# EAGLE design display300 (EAGLE 4.15)
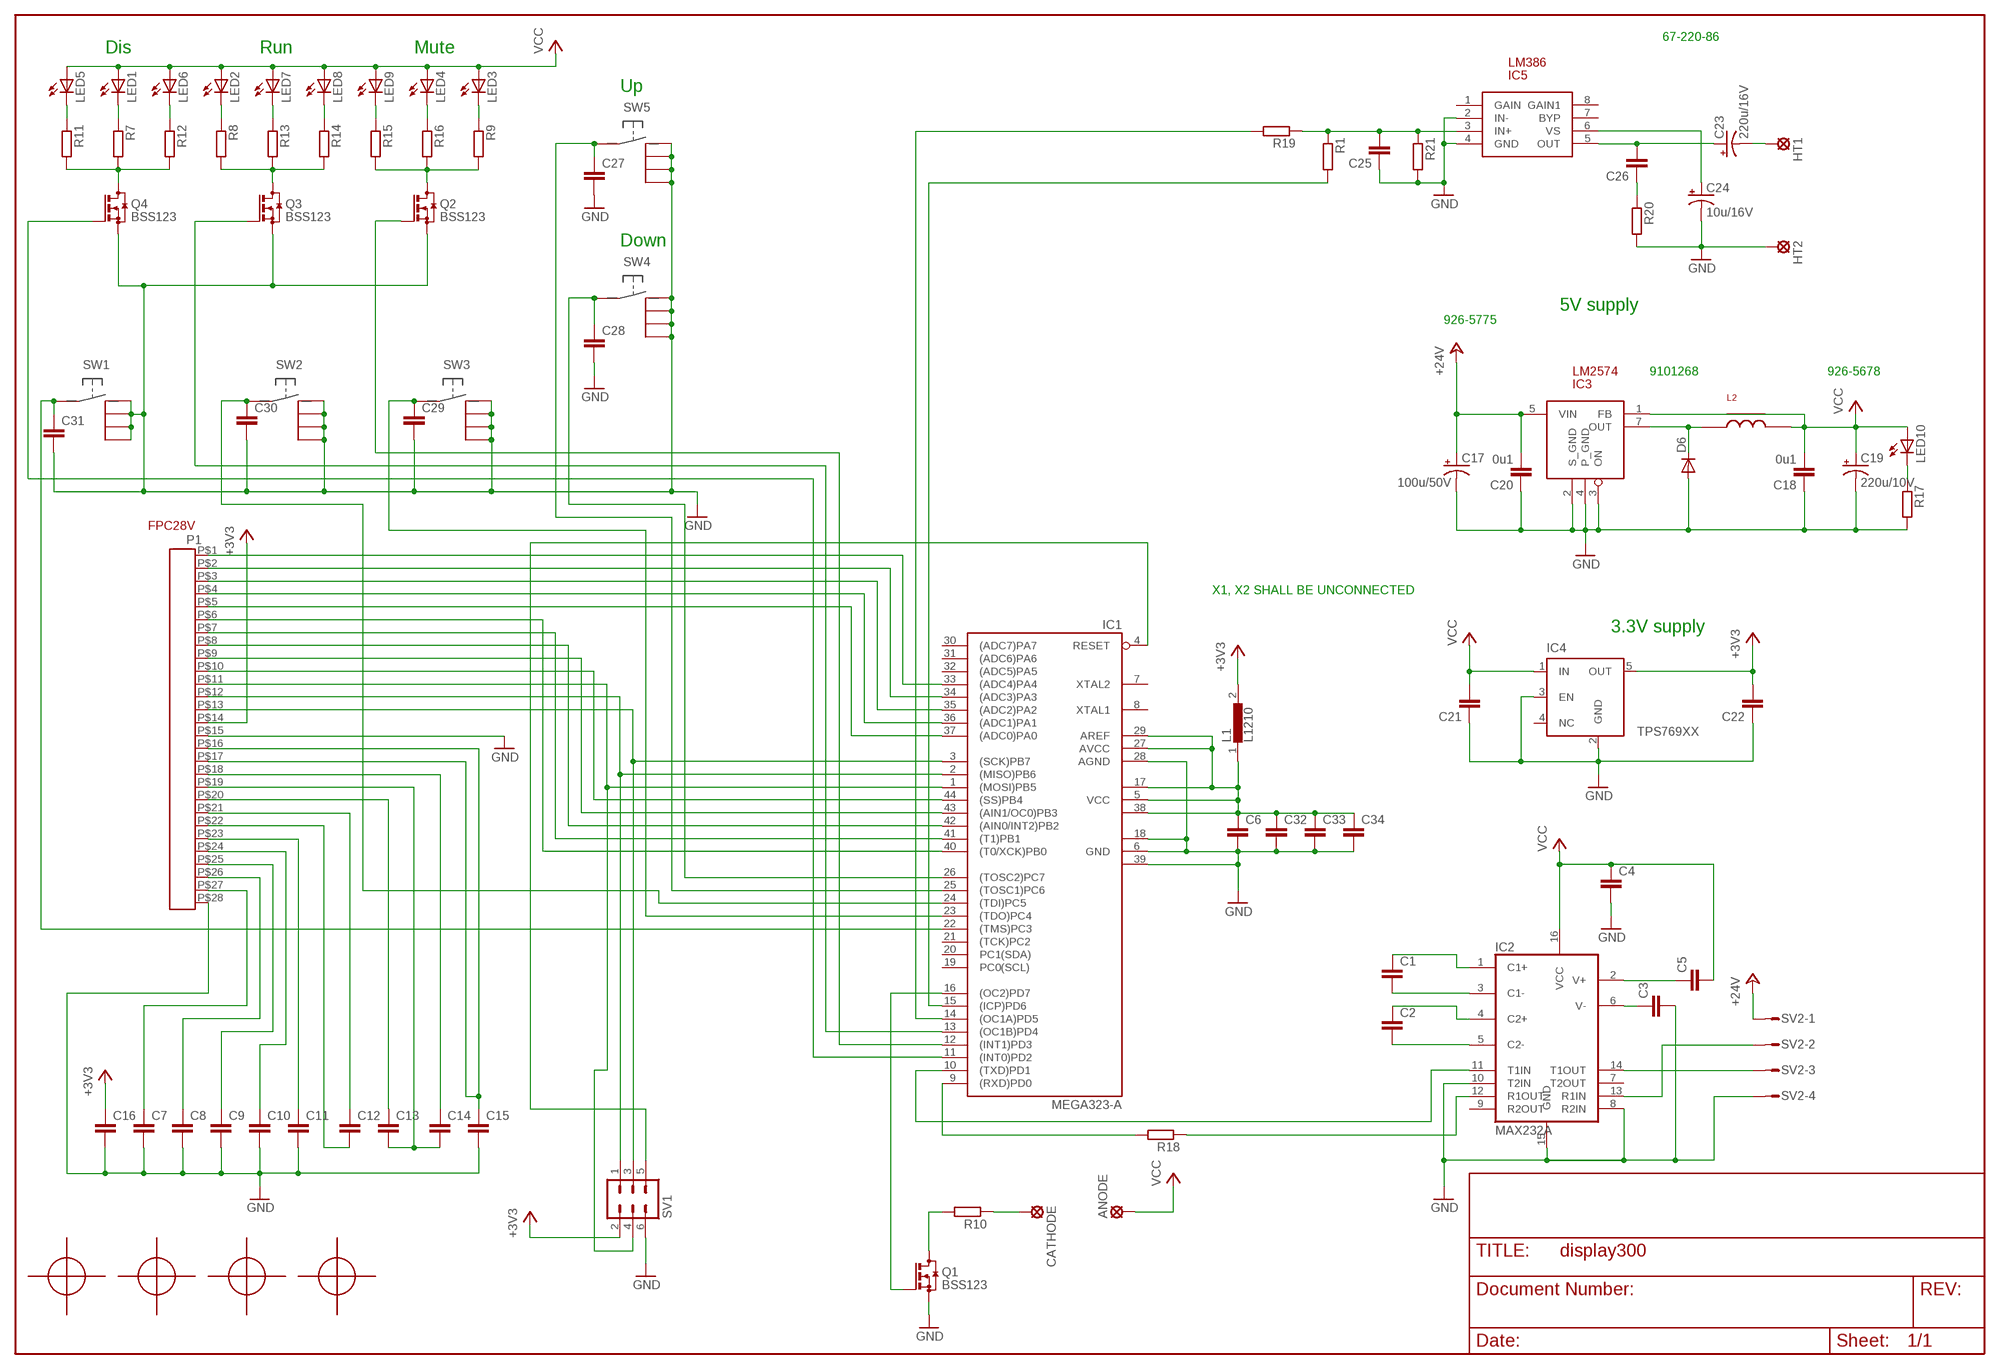
[diagram p0: schematic, sheet 1]

## Parts
ANODE  LSP13  [LSP13]
C1  C-EUC0805K  [C0805K]
C2  C-EUC0805K  [C0805K]
C3  C-EUC0805K  [C0805K]
C4  C-EUC0805K  [C0805K]
C5  C-EUC0805K  [C0805K]
C6  C-EUC0805K  [C0805K]
C7  C-EUC0805K  [C0805K]
C8  C-EUC0805K  [C0805K]
C9  C-EUC0805K  [C0805K]
C10  C-EUC0805K  [C0805K]
C11  C-EUC0805K  [C0805K]
C12  C-EUC0805K  [C0805K]
C13  C-EUC0805K  [C0805K]
C14  C-EUC0805K  [C0805K]
C15  C-EUC0805K  [C0805K]
C16  C-EUC0805K  [C0805K]
C17  100u/50V  CPOL-USE  [PANASONIC_E]
C18  0u1  C-EUC0805K  [C0805K]
C19  220u/10V  CPOL-USD  [PANASONIC_D]
C20  0u1  C-EUC0805K  [C0805K]
C21  C-EUC0805K  [C0805K]
C22  C-EUC0805K  [C0805K]
C23  220u/16V  CPOL-USD  [PANASONIC_D]
C24  10u/16V  CPOL-USB  [PANASONIC_B]
C25  C-EUC0805K  [C0805K]
C26  C-EUC0805K  [C0805K]
C27  C-EUC0805K  [C0805K]
C28  C-EUC0805K  [C0805K]
C29  C-EUC0805K  [C0805K]
C30  C-EUC0805K  [C0805K]
C31  C-EUC0805K  [C0805K]
C32  C-EUC0805K  [C0805K]
C33  C-EUC0805K  [C0805K]
C34  C-EUC0805K  [C0805K]
CATHODE  LSP13  [LSP13]
D6  DIODE-SMB  [SMB]
HT1  LSP13  [LSP13]
HT2  LSP13  [LSP13]
IC1  MEGA323-A  [TQFP44]
IC2  MAX232A  [SO16]
IC3  LM2574  [SO8]
IC4  TPS769XX  [SOT23-5]
IC5  LM386  [SO8]
L1  L1210  [C1210]
L2  IND_KOA_330U  [IND_KOA_330U]
LED1  LEDSMT1206  [1206]
LED2  LEDSMT1206  [1206]
LED3  LEDSMT1206  [1206]
LED4  LEDSMT1206  [1206]
LED5  LEDSMT1206  [1206]
LED6  LEDSMT1206  [1206]
LED7  LEDSMT1206  [1206]
LED8  LEDSMT1206  [1206]
LED9  LEDSMT1206  [1206]
LED10  LEDSMT1206  [1206]
P1  FPC28V  [FPC28V]
Q1  BSS123  [SOT23]
Q2  BSS123  [SOT23]
Q3  BSS123  [SOT23]
Q4  BSS123  [SOT23]
R1  R-EU_R0805W  [R0805W]
R7  R-EU_R0805W  [R0805W]
R8  R-EU_R0805W  [R0805W]
R9  R-EU_R0805W  [R0805W]
R10  R-EU_R0805W  [R0805W]
R11  R-EU_R0805W  [R0805W]
R12  R-EU_R0805W  [R0805W]
R13  R-EU_R0805W  [R0805W]
R14  R-EU_R0805W  [R0805W]
R15  R-EU_R0805W  [R0805W]
R16  R-EU_R0805W  [R0805W]
R17  R-EU_R0805W  [R0805W]
R18  R-EU_R0805W  [R0805W]
R19  R-EU_R0805W  [R0805W]
R20  R-EU_R0805W  [R0805W]
R21  R-EU_R0805W  [R0805W]
SV1  MA03-2  [MA03-2]
SV2  S04P  [S04P]
SW1  GPV_PUSH  [GPV_PUSH]
SW2  GPV_PUSH  [GPV_PUSH]
SW3  GPV_PUSH  [GPV_PUSH]
SW4  GPV_PUSH  [GPV_PUSH]
SW5  GPV_PUSH  [GPV_PUSH]
U$1  FEDUSIAL_1MM  [FEDUSIAL_1MM]
U$2  FEDUSIAL_1MM  [FEDUSIAL_1MM]
U$3  FEDUSIAL_1MM  [FEDUSIAL_1MM]
U$4  FEDUSIAL_1MM  [FEDUSIAL_1MM]

## Nets
+3V3: C16.1 C22.2 IC4.5(OUT) L1.2 P1.P$14 SV1.2
+24V: C17.+ C20.2 IC3.5(VIN) SV2.1
GND: C3.2 C4.2 C6.2 C7.2 C8.2 C9.2 C10.2 C11.2 C15.2 C16.2 C17.- C18.1 C19.- C20.1 C21.1 C22.1 C24.- C25.1 C27.2 C28.2 C29.2 C30.2 C31.2 C32.2 C33.2 C34.2 D6.A HT2.MP IC1.6(GND) IC1.18(GND1) IC1.28(AGND) IC1.39(GND2) IC2.8(R2IN) IC2.10(T2IN) IC2.15(GND) IC3.2(S_GND) IC3.3(ON) IC3.4(P_GND) IC4.2(GND) IC4.3(EN) IC5.2(IN-) IC5.4(GND) P1.P$15 P1.P$28 Q1.2(S) Q2.2(S) Q3.2(S) Q4.2(S) R17.2 R20.2 R21.2 SV1.6 SV2.4 SW1.P$2 SW1.P$3 SW1.P$4 SW1.P$5 SW2.P$2 SW2.P$3 SW2.P$4 SW2.P$5 SW3.P$2 SW3.P$3 SW3.P$4 SW3.P$5 SW4.P$2 SW4.P$3 SW4.P$4 SW4.P$5 SW5.P$2 SW5.P$3 SW5.P$4 SW5.P$5
N$1: IC1.40((T0/XCK)PB0) P1.P$6
N$2: IC1.41((T1)PB1) P1.P$7
N$3: IC1.42((AIN0/INT2)PB2) P1.P$8
N$4: IC1.43((AIN1/OC0)PB3) P1.P$9
N$5: IC1.44((SS)PB4) P1.P$10
N$6: IC1.1((MOSI)PB5) P1.P$11 SV1.4
N$7: IC1.2((MISO)PB6) P1.P$12 SV1.1
N$8: IC1.3((SCK)PB7) P1.P$13 SV1.3
N$9: IC1.37((ADC0)PA0) P1.P$5
N$10: IC1.36((ADC1)PA1) P1.P$4
N$11: IC1.35((ADC2)PA2) P1.P$3
N$12: IC1.34((ADC3)PA3) P1.P$2
N$13: IC1.33((ADC4)PA4) P1.P$1
N$14: C15.1 P1.P$16 P1.P$17
N$15: C27.1 IC1.25((TOSC1)PC6) SW5.P$1
N$16: C14.1 P1.P$18
N$17: C13.2 C14.2 P1.P$19
N$18: C13.1 P1.P$20
N$19: C12.1 P1.P$21
N$20: C12.2 P1.P$22
N$21: C11.1 P1.P$23
N$22: C10.1 P1.P$24
N$23: C9.1 P1.P$25
N$24: C8.1 P1.P$26
N$25: C7.1 P1.P$27
N$27: LED3.C R9.1
N$28: C6.1 C32.1 C33.1 C34.1 IC1.5(VCC) IC1.17(VCC1) IC1.27(AVCC) IC1.29(AREF) IC1.38(VCC2) L1.1
N$29: LED2.C R8.1
N$30: LED1.C R7.1
N$31: IC2.14(T1OUT) SV2.3
N$32: IC1.11((INT0)PD2) Q4.1(G)
N$33: IC2.13(R1IN) SV2.2
N$34: IC1.10((TXD)PD1) IC2.11(T1IN)
N$35: IC1.9((RXD)PD0) R18.2
N$36: C2.2 IC2.5(C2-)
N$37: C2.1 IC2.4(C2+)
N$38: C1.2 IC2.3(C1-)
N$39: C1.1 IC2.1(C1+)
N$40: C5.1 IC2.2(V+)
N$41: C3.1 IC2.6(V-)
N$42: IC1.13((OC1B)PD4) Q3.1(G)
N$43: IC1.4(RESET) SV1.5
N$44: IC1.12((INT1)PD3) Q2.1(G)
N$45: LED5.C R11.1
N$46: Q1.3(D) R10.2
N$47: LED6.C R12.1
N$48: LED7.C R13.1
N$49: Q4.3(D) R7.2 R11.2 R12.2
N$50: Q3.3(D) R8.2 R13.2 R14.2
N$51: CATHODE.MP R10.1
N$52: D6.C IC3.7(OUT) L2.P$1
N$53: Q2.3(D) R9.2 R15.2 R16.2
N$54: IC1.16((OC2)PD7) Q1.1(G)
N$55: LED10.C R17.1
N$56: LED8.C R14.1
N$57: LED9.C R15.1
N$58: LED4.C R16.1
N$59: IC2.12(R1OUT) R18.1
N$60: C23.+ C26.2 IC5.5(OUT)
N$61: C26.1 R20.1
N$62: C24.+ IC5.6(VS)
N$63: C23.- HT1.MP
N$64: C25.2 IC5.3(IN+) R1.1 R19.1 R21.1
N$65: IC1.14((OC1A)PD5) R19.2
N$66: IC1.15((ICP)PD6) R1.2
N$68: C28.1 IC1.26((TOSC2)PC7) SW4.P$1
N$71: C31.1 IC1.22((TMS)PC3) SW1.P$1
N$72: C30.1 IC1.24((TDI)PC5) SW2.P$1
N$73: C29.1 IC1.23((TDO)PC4) SW3.P$1
VCC: ANODE.MP C4.1 C5.2 C18.2 C19.+ C21.2 IC2.16(VCC) IC3.1(FB) IC4.1(IN) L2.P$4 LED1.A LED2.A LED3.A LED4.A LED5.A LED6.A LED7.A LED8.A LED9.A LED10.A
Unconnected: IC1.7(XTAL2) IC1.8(XTAL1) IC1.19(PC0(SCL)) IC1.20(PC1(SDA)) IC1.21((TCK)PC2) IC1.30((ADC7)PA7) IC1.31((ADC6)PA6) IC1.32((ADC5)PA5) IC2.7(T2OUT) IC2.9(R2OUT) IC4.4(NC) IC5.1(GAIN) IC5.7(BYP) IC5.8(GAIN1)

## Notes on the sheet
- 67-220-86
- Dis | Run | Mute
- Up
- Down
- 5V supply
- 926-5775
- 9101268 | 926-5678
- X1, X2 SHALL BE UNCONNECTED
- 3.3V supply

## Library data of the parts
ANODE CATHODE HT1 HT2 = solpad:LSP13: SOLDER PAD drill 1.3 mm, distributor Buerklin, 12H562
C1-C16 C18 C20-C22 C25-C34 = rcl:C-EU: CAPACITOR, European symbol
C17 C19 C23 C24 = rcl:CPOL-US: POLARIZED CAPACITOR, American symbol
D6 = diode:DIODE-: DIODE
IC1 = avr:MEGA323: MICROCONTROLLER 32 Kbytes FLASH 2 Kbytes SRAM 1 Kbytes EEPROM USART 8-channel 10 bit ADC
IC2 = lbm:MAX232A
IC3 = lbm:LM2574
IC4 = lbm:TPS769XX
IC5 = lbm:LM386
L1 = lbm:L1210
L2 = lbm:IND_KOA_330U
LED1-LED10 = led:LED: LED OSRAM: - CHIPLED LG R971, LG N971, LY N971, LG Q971, LY Q971, LO R971, LY R971 LH N974, LH R974 LS Q976, LO Q976, LY Q976 LO Q996 - Hyper CHIPLED LW Q18S LB Q993, LB Q99A, LB R99A - SideLED LS A670, LO A670, LY A670, LG A670, LP A670 LB A673, LV A673, LT A673, LW A673 LH A674 LY A675 LS A676, LA A676, LO A676, LY A676, LW A676 LS A679, LY A679, LG A679 - Hyper Micro SIDELED® LS Y876, LA Y876, LO Y876, LY Y876 LT Y87S - SmartLED LW L88C, LW L88S LB L89C, LB L89S, LG L890 LS L89K, LO L89K, LY L89K LS L896, LA L896, LO L896, LY L896 - TOPLED LS T670, LO T670, LY T670, LG T670, LP T670 LSG T670, LSP T670, LSY T670, LOP T670, LYG T670 LG T671, LOG T671, LSG T671 LB T673, LV T673, LT T673, LW T673 LH T674 LS T676, LA T676, LO T676, LY T676, LB T676, LH T676, LSB T676, LW T676 LB T67C, LV T67C, LT T67C, LS T67K, LO T67K, LY T67K, LW E67C LS E67B, LA E67B, LO E67B, LY E67B, LB E67C, LV E67C, LT E67C LW T67C LS T679, LY T679, LG T679 LS T770, LO T770, LY T770, LG T770, LP T770 LB T773, LV T773, LT T773, LW T773 LH T774 LS E675, LA E675, LY E675, LS T675 LS T776, LA T776, LO T776, LY T776, LB T776 LHGB T686 LT T68C, LB T68C - Hyper Mini TOPLED® LB M676 - Mini TOPLED Santana® LG M470 LS M47K, LO M47K, LY M47K Source: http://www.osram.convergy.de/
P1 = lbm:FPC28V
Q1-Q4 = transistor-small-signal:BSS123: N-CHANNEL MOS FET
R1 R7-R21 = rcl:R-EU_: RESISTOR, European symbol
SV1 = con-lstb:MA03-2: PIN HEADER
SV2 = con-amp-mt:S04P: AMP MT CONNECTOR
SW1-SW5 = lbm:GPV_PUSH
U$1-U$4 = lbm:FEDUSIAL_1MM

## Board
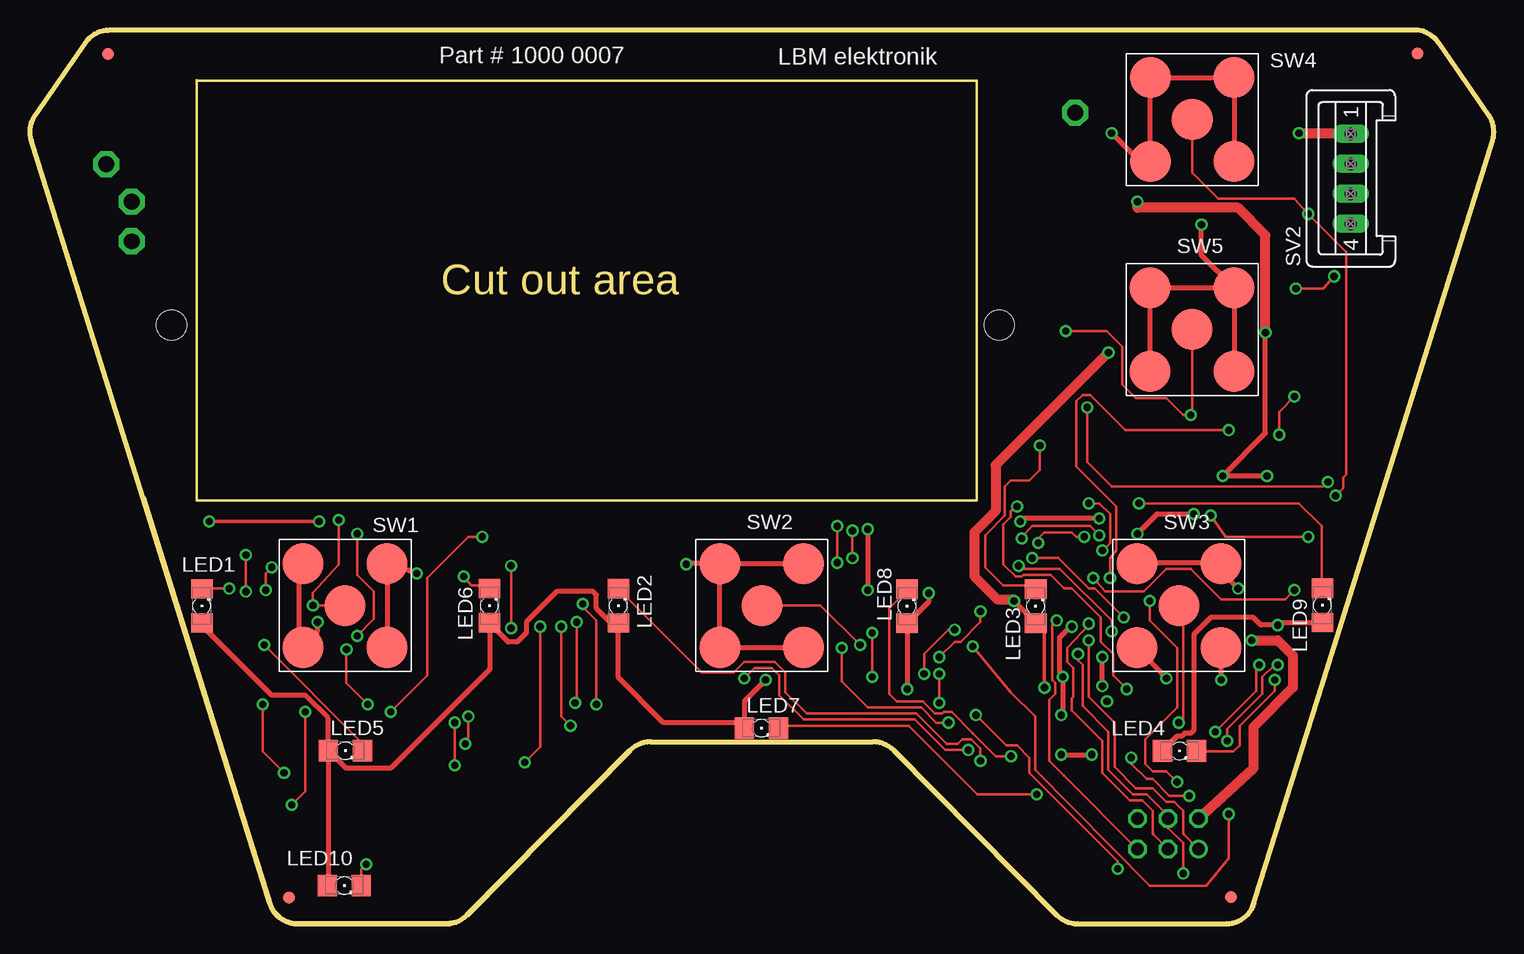
[diagram p1: board, top side]
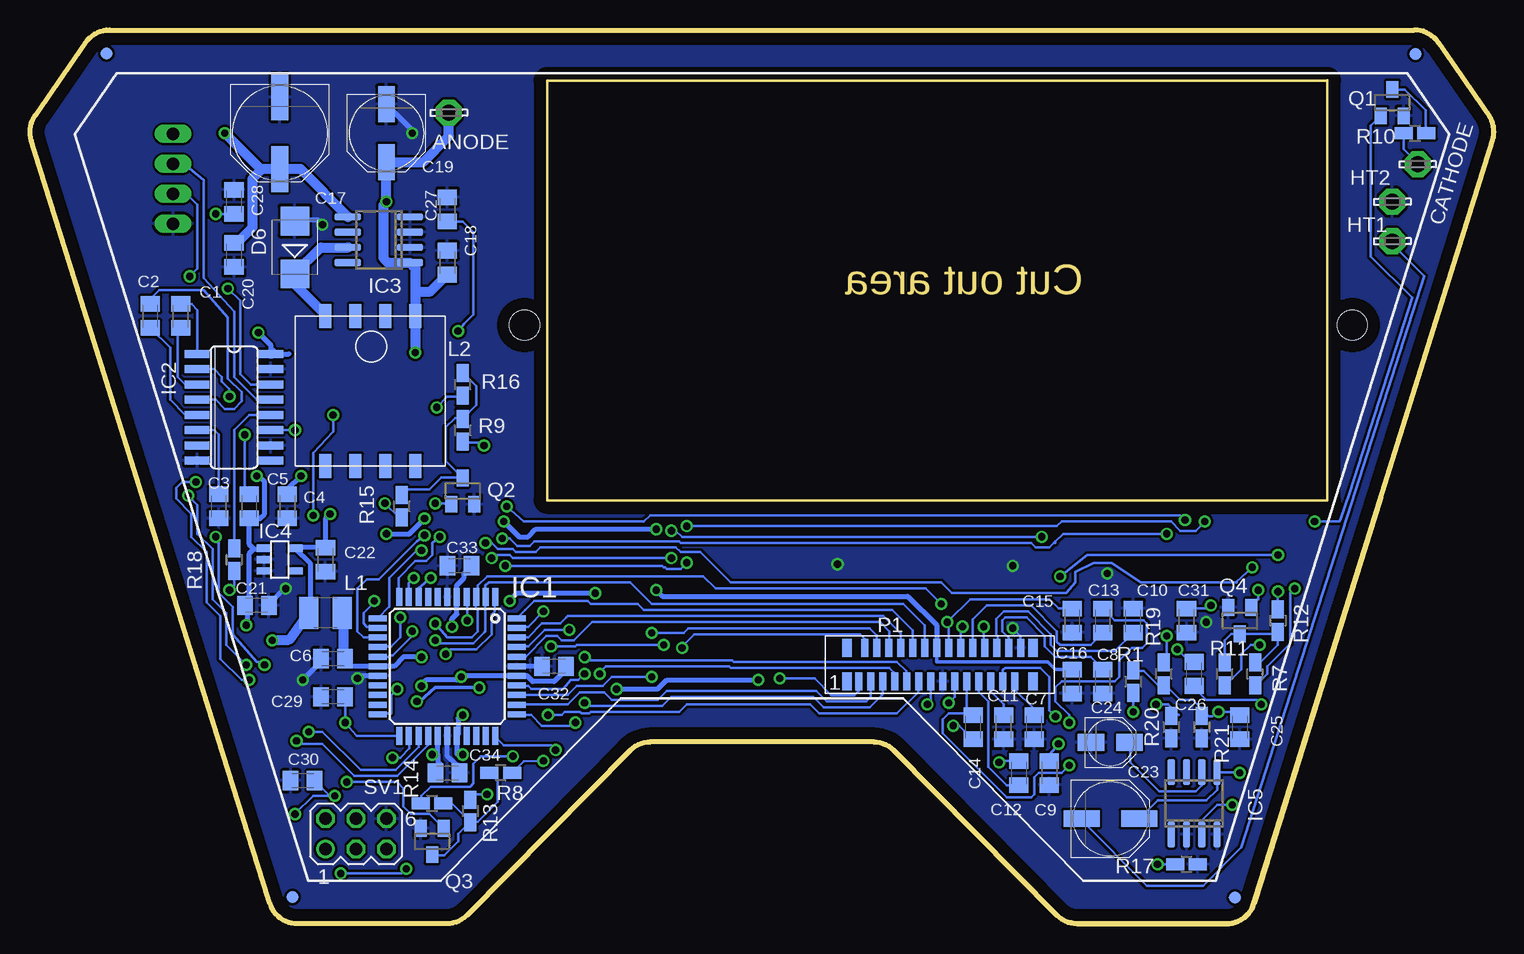
[diagram p2: board, bottom side, seen from below]

Size 121.99 x 74.52 mm. Coordinates in mm from the lower left corner, seen from the top.
Outline: 124 segments
Copper layers (1*16): Top 0.035mm / dielectric 1.5mm / Bottom 0.035mm
Design rules "default": minimum track width 8mil, minimum drill 20mil, track to track 8mil, track to pad 8mil, pad to pad 7mil, via to via 8mil, smd to smd 8mil, copper to edge 40mil, drill to drill 8mil, minimum pad ring 10mil, minimum via ring 8mil, stop-mask expansion 4mil, vias tented up to drill 0mil, thermal gap 10mil
Holes 2.5 mm at 80.78,49.92 11.79,49.92

### Footprints (pad centres in the part's own frame; a part is rotated, then mirrored left to right if it is on the bottom)
LSP13 = drill 1.321 pad 2.159 octagon: MP 0,0
C0805K = smd 1.3 x 1.6: 1 -1,0; 2 1,0
PANASONIC_E = smd 3.8 x 1.4: + 3,0; - -3,0
PANASONIC_D = smd 3 x 1.4: + 2.4,0; - -2.4,0
PANASONIC_B = smd 2.2 x 1.4: + 1.6,0; - -1.6,0
SMB = smd 2.4 x 2.4: A 2.2,0; C -2.2,0
TQFP44 = smd 1.5 x 0.5: 1 -5.8,4; 2 -5.8,3.2; 3 -5.8,2.4; 4 -5.8,1.6; 5 -5.8,0.8; 6 -5.8,0; 7 -5.8,-0.8; 8 -5.8,-1.6; 9 -5.8,-2.4; 10 -5.8,-3.2; 11 -5.8,-4; 23 5.8,-4; 24 5.8,-3.2; 25 5.8,-2.4; 26 5.8,-1.6; 27 5.8,-0.8; 28 5.8,0; 29 5.8,0.8; 30 5.8,1.6; 31 5.8,2.4; 32 5.8,3.2; 33 5.8,4 | smd 0.5 x 1.5: 12 -4,-5.8; 13 -3.2,-5.8; 14 -2.4,-5.8; 15 -1.6,-5.8; 16 -0.8,-5.8; 17 0,-5.8; 18 0.8,-5.8; 19 1.6,-5.8; 20 2.4,-5.8; 21 3.2,-5.8; 22 4,-5.8; 34 4,5.8; 35 3.2,5.8; 36 2.4,5.8; 37 1.6,5.8; 38 0.8,5.8; 39 0,5.8; 40 -0.8,5.8; 41 -1.6,5.8; 42 -2.4,5.8; 43 -3.2,5.8; 44 -4,5.8
SO16 = smd 0.66 x 2.032: 1 -4.445,-3.073; 2 -3.175,-3.073; 3 -1.905,-3.073; 4 -0.635,-3.073; 5 0.635,-3.073; 6 1.905,-3.073; 7 3.175,-3.073; 8 4.445,-3.073; 9 4.445,3.073; 10 3.175,3.073; 11 1.905,3.073; 12 0.635,3.073; 13 -0.635,3.073; 14 -1.905,3.073; 15 -3.175,3.073; 16 -4.445,3.073
SO8 = smd 0.6 x 2.2: 1 -1.905,-2.6; 2 -0.635,-2.6; 3 0.635,-2.6; 4 1.905,-2.6; 5 1.905,2.6; 6 0.635,2.6; 7 -0.635,2.6; 8 -1.905,2.6
SOT23-5 = smd 0.6 x 1.2: 1 -0.95,-1.306; 2 0,-1.306; 3 0.95,-1.306; 4 0.95,1.306; 5 -0.95,1.306
C1210 = smd 1.6 x 2.7: 1 -2.67,2.54; 2 0.13,2.54
IND_KOA_330U = smd 2 x 1: P$1 0,0; P$2 0,2.5; P$3 0,5; P$4 0,7.5; P$5 12.5,0; P$6 12.5,2.5; P$7 12.5,5; P$8 12.5,7.5
1206 = smd 1.6 x 1.803: A -1.422,0; C 1.422,0
FPC28V = smd 0.6 x 1.5: P$1 0,0; P$2 0.5,2.8; P$3 1,0; P$4 1.5,2.8; P$5 2,0; P$6 2.5,2.8; P$7 3,0; P$8 3.5,2.8; P$9 4,0; P$10 4.5,2.8; P$11 5,0; P$12 5.5,2.8; P$13 6,0; P$14 6.5,2.8; P$15 7,0; P$16 7.5,2.8; P$17 8,0; P$18 8.5,2.8; P$19 9,0; P$20 9.5,2.8; P$21 10,0; P$22 10.5,2.8; P$23 11,0; P$24 11.5,2.8; P$25 12,0; P$26 12.5,2.8; P$27 13,0; P$28 13.5,2.8 | smd 0.8 x 1.5: P$29 -1,0; P$30 -1,2.8; P$31 14.5,2.8; P$32 14.5,0
SOT23 = smd 1 x 1.4: 1 -0.95,-1.1; 2 0.95,-1.1; 3 0,1.1
R0805W = smd 1.5 x 1: 1 -0.94,0; 2 0.94,0
MA03-2 = drill 1.016 round: 1 -2.54,-1.27 | drill 1.016 octagon: 2 -2.54,1.27; 3 0,-1.27; 4 0,1.27; 5 2.54,-1.27; 6 2.54,1.27
S04P = drill 1.016 long: 1 3.75,0; 2 1.25,0; 3 -1.25,0; 4 -3.75,0
GPV_PUSH = smd 3.4 x 3.4: P$1 0,0; P$2 -3.493,3.493; P$3 3.493,3.493; P$4 3.493,-3.493; P$5 -3.493,-3.493
FEDUSIAL_1MM = smd 1 x 1: P$1 0,0 | smd 1 x 1 bottom: P$2 0,0

### Placement (x,y rotation side)
ANODE  87.09,67.61 0 bottom
C1  109.43,50.67 270 bottom
C2  111.97,50.67 270 bottom
C3  106.26,34.8 270 bottom
C4  100.54,34.8 270 bottom
C5  103.72,34.8 270 bottom
C6  96.73,22.1 180 bottom
C7  38.31,16.38 270 bottom
C8  32.6,20.19 270 bottom
C9  37.04,12.57 270 bottom
C10  30.06,25.27 90 bottom
C11  40.85,16.38 270 bottom
C12  39.58,12.57 90 bottom
C13  32.6,25.27 90 bottom
C14  43.39,16.38 90 bottom
C15  35.14,25.27 270 bottom
C16  35.14,20.19 270 bottom
C17  101.18,65.91 270 bottom
C18  87.21,55.12 270 bottom
C19  92.29,65.91 270 bottom
C20  104.99,55.75 90 bottom
C21  103.08,26.54 180 bottom
C22  97.37,30.35 90 bottom
C23  31.96,8.76 0 bottom
C24  31.96,15.11 0 bottom
C25  21.17,16.38 90 bottom
C26  24.98,20.83 270 bottom
C27  87.21,59.56 90 bottom
C28  104.99,60.2 90 bottom
C29  96.73,18.92 180 bottom
C30  99.27,11.94 180 bottom
C31  25.61,25.27 270 bottom
C32  78.32,21.46 180 bottom
C33  86.19,29.84 180 bottom
C34  87.21,12.57 0 bottom
CATHODE  6.35,63.31 0 bottom
D6  99.91,56.39 90 bottom
HT1  8.47,56.9 0 bottom
HT2  8.47,60.2 0 bottom
IC1  87.21,21.46 270 bottom
IC2  104.99,43.05 270 bottom
IC3  92.92,57.02 90 bottom
IC4  101.18,30.35 270 bottom
IC5  24.98,10.03 0 bottom
L1  98.64,28.45 180 bottom
L2  97.37,50.67 270 bottom
LED1  14.32,26.5 90 top
LED2  49.03,26.51 90 top
LED3  83.81,26.47 90 top
LED4  95.79,14.41 0 top
LED5  26.28,14.43 0 top
LED6  38.29,26.52 90 top
LED7  60.95,16.32 0 top
LED8  73.09,26.47 90 top
LED9  107.71,26.55 90 top
LED10  26.19,3.19 0 top
P1  52.92,20.19 0 bottom
Q1  8.47,68.45 0 bottom
Q2  85.94,36.07 0 bottom
Q3  88.48,6.86 180 bottom
Q4  21.17,25.27 180 bottom
R1  30.06,20.19 270 bottom
R7  19.9,20.83 90 bottom
R8  82.76,12.57 180 bottom
R9  85.94,41.15 90 bottom
R10  6.56,65.91 0 bottom
R11  22.44,20.83 90 bottom
R12  17.99,25.27 270 bottom
R13  85.3,9.4 270 bottom
R14  88.48,10.03 0 bottom
R15  91.02,34.8 90 bottom
R16  85.94,44.96 90 bottom
R17  25.61,4.95 0 bottom
R18  104.99,30.35 270 bottom
R19  27.52,20.83 90 bottom
R20  26.88,16.38 270 bottom
R21  24.34,16.38 270 bottom
SV1  94.83,7.49 0 bottom
SV2  110.07,62.1 90 top
SW1  26.25,26.53 0 top
SW2  60.98,26.53 0 top
SW3  95.74,26.52 0 top
SW4  96.85,67.05 0 top
SW5  96.84,49.54 0 top
U$1  6.52,72.53 0 top
U$2  115.61,72.56 0 top
U$3  21.58,2.18 0 top
U$4  100.1,2.21 0 top

### Tracks (layer width: path | path; a pad name or v marks a point on that pad's centre or on a via)
+3V3  (via drill 0.6)
  Top 0.406: v69.81,32.89 v69.81,27.81 | v82.51,33.53 82.76,33.78 v89.11,33.78 | v92.29,32.51 93.94,34.16 v96.99,34.16
  Top 0.813: SV1.2 101.94,12.95 101.94,16.38 105.24,19.69 105.24,22.35 103.97,23.62 v101.81,23.62
  Bottom 0.203: P1.P$14 46.44,22.99 46.44,22.48 | 100.33,23.72 arc45 100.55,23.62
  Bottom 0.305: 46.44,22.48 46.42,21.83 46.41,21.84 37.17,21.84 36.53,21.21 35.14,21.21 C16.1
  Bottom 0.406: P1.P$14 46.44,23.02 46.44,24.89 48.85,27.31 69.3,27.31 v69.81,27.81 | C22.2 97.37,31.37 | 97.37,31.37 99.81,31.37 IC4.5 98.64,30.07 98.64,26.42 98.76,26.29 L1.2 | 97.37,31.37 97.11,31.62 | v69.81,32.89 79.84,32.89 80.48,32.26 81.24,32.26 v82.51,33.53 | v89.11,33.78 90.38,32.51 v92.29,32.51 | C22.2 97.37,31.24 | v96.99,34.16 97.37,33.78 C22.2
  Bottom 0.813: L1.2 100.33,23.72 | 100.55,23.62 v101.81,23.62
+24V  (via drill 0.6)
  Top 0.813: SV2.1 110.07,65.91 v105.75,65.91
  Bottom 0.813: 102.7,62.91 C17.+ 99.45,62.91 95.46,58.93 IC3.5 | 102.7,62.91 102.75,62.91 v105.75,65.91 | C20.2 104.75,56.75 103.46,58.04 103.46,62.1 102.7,62.87 102.7,62.91
GND  (via drill 0.6)
  Top 0.203: SW3.P$3 99.23,29.38 | v40.09,24.64 v40.09,29.84
  Top 0.406: 57.49,29.97 | 57.44,30.02 SW2.P$2 57.49,29.97 | 57.44,30.02 57.36,30.1 | 64.47,30.23 64.48,30.22 SW2.P$3 57.54,30.02 57.49,29.97 | 29.8,28.96 29.75,29.27 SW1.P$3 29.8,30.08 | SW1.P$2 22.74,30.02 22.69,29.97 22.76,29.9 22.44,29.58 22.44,23.5 22.69,23.24 22.69,23.11 | 22.69,23.11 SW1.P$5 22.69,23.11 | 29.8,30.08 29.8,30.1 | SW1.P$4 29.8,23.09 29.8,28.96 | 29.8,28.96 29.8,30.08 | 92.21,22.99 92.16,22.99 | SW3.P$5 92.21,22.99 | 92.16,29.92 SW3.P$2 92.33,30.1 99.27,30.1 99.27,30.05 SW3.P$3 | 99.27,23.07 SW3.P$4 99.27,22.99 v99.27,20.32 | SW4.P$3 SW4.P$2 SW4.P$5 | SW4.P$3 100.48,70.54 100.54,70.48 | SW4.P$4 100.42,63.63 100.35,63.7 SW4.P$3 | SW4.P$5 | SW4.P$5 93.3,63.5 92.54,63.5 v90.13,65.91 | SW5.P$2 93.36,53.03 SW5.P$2 | SW5.P$5 SW5.P$2 | SW5.P$2 | SW5.P$2 93.3,53.09 | SW5.P$3 100.33,53 100.29,52.96 100.33,52.91 SW5.P$4 | SW5.P$2 93.38,53.03 93.43,53.09 93.49,53.03 SW5.P$3 | SW5.P$3 97.62,55.74 v97.62,58.29 | 99.23,29.38 v100.67,27.94 | 92.21,22.99 92.29,22.99 v94.7,20.45 | 29.8,28.96 30.69,29.84 v32.22,29.21 | v23.96,25.15 23.96,24.38 22.69,23.11 | 57.44,30.02 54.74,30.02 v54.7,29.97 | SW2.P$4 57.54,23.04 57.49,22.99 | 57.49,22.99 57.49,29.97 | SW2.P$5 57.49,22.99
  Bottom 0.203: R17.2 24.72,4.95 | 102.19,26.54 C21.1 | v100.67,27.94 100.8,27.94 | P1.P$28 39.46,23.03 39.46,24 v40.09,24.64 | v40.09,29.84 39.84,29.84
  Bottom 0.406: 29.93,26.29 29.95,26.27 C10.2 | C31.2 25.61,24.26 25.87,24 | C19.- 92.29,68.33 90.13,66.17 v90.13,65.91 | IC3.2 90.26,56.39 | D6.A 99.91,58.67 98,58.67 v97.62,58.29 | C6.2 97.75,22.1 97.75,21.84 v99.27,20.32 | 100.8,27.94 102.19,26.54 | 92.97,20.7 92.92,20.7 | 92.97,20.7 IC1.18 | v94.7,20.45 94.57,20.7 92.97,20.7 | IC1.28 87.21,13.97 86.45,13.21 86.45,12.7 86.32,12.57 C34.2 | C32.2 IC1.39 | v54.7,29.97 54.31,29.97
  pour Bottom: 6.18,74.04 115.66,74.04 115.91,73.79 121.5,66.04 101.05,0.89 86.32,0.89 71.59,15.49 50.76,15.62 35.39,0.63 21.17,0.63 0.34,66.04 6.05,74.04
N$1
  Bottom 0.203: P1.P$6 50.38,22.99 50.38,24.38 51.14,25.15 75.14,25.15 76.67,23.62 77.68,23.62 78.06,24 78.95,24 80.69,22.26 IC1.40
N$2  (via drill 0.6)
  Top 0.203: v77.05,24.51 76.54,24.51 74.51,22.48 v74.51,20.83
  Bottom 0.203: 80.98,23.11 arc-45 81.2,23.02 81.24,22.99 81.25,23 arc-45 IC1.41 81.37,23.11 80.48,23.11 79.08,24.51 v77.05,24.51 | P1.P$7 50,20.27 50,20.95 50.38,21.34 63.59,21.34 63.71,21.46 74,21.46 74.51,20.95 v74.51,20.83
N$3
  Bottom 0.203: IC1.42 81.25,23.86 81.24,23.88 80.48,23.88 79.33,25.02 77.81,25.02 77.3,25.53 77.17,25.65 50.89,25.65 49.42,24.19 P1.P$8
N$4  (via drill 0.6)
  Top 0.203: v79.21,26.03 79.21,25.15 77.56,23.5 77.05,23.5 v75.78,22.22
  Bottom 0.203: 81.37,24.64 arc45 81.39,24.65 IC1.43 81.39,24.66 81.37,24.64 | v79.21,26.03 80.48,24.76 81.24,24.76 81.37,24.64 | P1.P$9 48.98,20.26 48.98,21.08 49.74,21.84 63.33,21.84 63.46,21.97 75.52,21.97 v75.78,22.22
N$5
  Bottom 0.203: IC1.44 80.71,26.16 80.73,26.16 79.97,26.92 75.52,26.92 75.27,26.67 71.33,26.67 70.82,26.16 50.12,26.16 48.42,24.46 P1.P$10
N$6  (via drill 0.6)
  Top 0.203: v87.33,22.48 87.33,21.97 87.72,21.59 87.72,18.16 89.87,16 89.87,12.83 91.91,10.79 93.05,10.79 94.83,9.02 SV1.4 94.83,8 96.1,6.73 v96.1,4.19 | v78.83,17.4 81.37,14.86 82.25,14.86 83.27,13.84 83.27,12.57 90.64,5.21 v90.64,4.57
  Bottom 0.203: 48.01,19.77 arc-45 47.92,19.99 P1.P$11 47.96,20.19 47.96,19.3 49.74,17.53 56.22,17.53 56.98,18.29 67.27,18.29 67.9,17.65 75.27,17.65 75.4,17.53 76.03,17.53 76.16,17.65 77.43,17.65 77.68,17.4 v78.83,17.4 | IC1.1 83.25,27.22 arc-45 83.27,27.18 83.27,26.03 83.52,25.78 83.52,24.13 84.79,22.86 86.95,22.86 v87.33,22.48 | v90.64,4.57 91.02,4.19 v96.1,4.19
N$7  (via drill 0.6)
  Top 0.203: SV1.1 96.19,7.4 arc-45 96.1,7.62 | v88.22,23.62 88.22,18.92 90.38,16.76 90.38,13.08 92.16,11.3 93.56,11.3 94.7,10.16 95.34,10.16 96.1,9.4 96.1,7.62 | 96.1,7.62
  Bottom 0.203: 88.48,23.88 v88.22,23.62 87.97,23.37 85.05,23.37 84.13,24.29 arc-45 84.03,24.52 84.03,27.2 arc45 IC1.2 84.03,27.29 84.03,28.19 83.78,28.45 72.48,28.45 71.97,28.45 70.19,26.67 49.23,26.67 47.42,24.85 P1.P$12
N$8  (via drill 0.6)
  Top 0.203: SV1.3 93.65,7.4 arc-45 93.56,7.62 93.56,9.4 92.67,10.29 91.65,10.29 89.37,12.57 89.37,15.24 86.83,17.78 86.83,18.8 86.95,18.92 86.95,21.34 86.45,21.84 86.45,22.99 88.22,24.89 v88.22,25.02 | v47.2,18.29 47.2,25.27 46.06,26.42 v46.06,26.67
  Bottom 0.203: 84.79,27.18 arc45 84.81,27.21 IC1.3 | 84.79,27.18 84.83,27.14 84.83,26.32 84.67,26.16 84.67,24.38 85.18,23.88 87.21,23.88 v88.22,25.02 | P1.P$13 46.92,18.57 v47.2,18.29 | v46.06,26.67 47.33,27.94 64.86,27.94 65.87,28.96 83.91,28.96 84.67,28.19 84.67,27.31 84.79,27.18
N$9  (via drill 0.6)
  Top 0.203: v75.78,18.41 v75.78,20.83
  Bottom 0.203: P1.P$5 50.92,19.28 arc45 51.01,19.05 52.03,18.03 55.84,18.03 56.73,18.92 68.54,18.92 69.3,18.16 75.65,18.16 75.65,18.29 v75.78,18.41 | IC1.37 arc-45 81.28,19.81 80.48,19.81 80.22,19.56 77.56,19.56 76.92,20.32 76.29,20.32 v75.78,20.83
N$10  (via drill 0.6)
  Top 0.203: v70.19,24.26 v70.19,20.57
  Bottom 0.203: IC1.36 77.16,19.06 76.41,19.81 74.25,19.81 73.49,20.57 v70.19,20.57 | P1.P$4 51.42,24.03 52.03,24.64 67.14,24.64 67.52,24.26 v70.19,24.26
N$11
  Bottom 0.203: P1.P$3 51.92,19.04 arc45 52.01,18.81 52.28,18.54 55.58,18.54 56.47,19.43 68.92,19.43 69.68,18.67 73.49,18.67 74.13,19.3 76.16,19.3 77.17,18.29 81.38,18.29 IC1.35 81.51,18.16
N$12  (via drill 0.6)
  Top 0.203: v67.65,22.99 67.65,20.19 69.81,18.03 74.25,18.03 75.52,16.76 v76.54,16.76
  Bottom 0.203: IC1.34 81.34,17.4 80.22,17.4 79.33,16.51 76.79,16.51 v76.54,16.76 | P1.P$2 52.41,23.75 52.79,24.13 66.63,24.13 67.65,23.11 v67.65,22.99
N$13  (via drill 0.6)
  Top 0.203: v78.19,14.48 76.29,14.48 73.75,17.02 64.47,17.02 62.44,19.05 62.44,20.7 61.81,21.34 60.41,21.34 v59.52,20.45
  Bottom 0.203: 52.92,20.83 P1.P$1 52.92,19.56 arc45 53.01,19.34 53.3,19.05 55.2,19.05 56.6,20.45 v59.52,20.45 | 83.14,15.62 83.17,15.62 IC1.33 83.14,15.73 | v78.19,14.48 78.57,14.86 82.51,14.86 83.14,15.49 83.14,15.73 | 83.14,15.73 83.14,15.75
N$14  (via drill 0.6)
  Top 0.203: v45.42,18.41 45.55,18.54 v45.55,25.15
  Bottom 0.203: P1.P$16 45.42,24.65 45.42,24.64 45.42,25.15 | 45.42,25.15 45.42,25.27 43.65,27.05 37.04,27.05 36.28,26.29 35.14,26.29 C15.1 | P1.P$17 44.92,18.92 v45.42,18.41 | 45.42,25.15 v45.55,25.15
N$15  (via drill 0.6)
  Top 0.203: v98.38,34.04 99.65,32.26 v106.51,32.26 | v98.76,16 102.19,19.43 102.19,21.34 v102.45,21.59 | v86.32,49.4 89.75,49.4 91.02,48.13 91.02,44.96 92.16,43.81 94.7,43.81 96.1,42.42 v96.73,42.42 96.86,42.54 96.86,49.56 | 96.86,49.56 96.86,49.66 | 96.86,49.56 SW5.P$1
  Bottom 0.203: v106.51,32.26 106.26,32.26 106.26,31.75 106.32,31.69 106.26,31.62 106.26,27.56 105.11,26.42 105.11,24.13 103.08,21.84 102.83,21.84 v102.45,21.59 | IC1.25 89.61,14.75 91.53,12.83 94.45,12.83 97.62,16 v98.76,16 | v96.73,42.42 96.73,41.02 98.38,39.24 v98.38,34.04 | v86.32,49.4 85.81,50.04 85.05,50.8 85.05,57.66 85.94,58.55 87.21,58.55 C27.1
N$16  (via drill 0.6)
  Top 0.203: v44.28,24.76 44.28,17.27 v45.04,16.51
  Bottom 0.203: P1.P$18 44.42,24.63 v44.28,24.76 | C14.1 43.39,15.37 44.54,16.51 v45.04,16.51
N$17  (via drill 0.6)
  Top 0.203: v35.39,13.21 v35.39,16.76
  Bottom 0.203: P1.P$19 43.92,17.92 43.39,17.4 C14.2 43.39,17.15 43.77,17.53 45.42,17.53 45.93,17.02 45.93,15.88 40.6,10.54 38.57,10.54 38.31,10.79 38.31,12.19 37.93,12.57 36.03,12.57 v35.39,13.21 | v35.39,16.76 35.39,17.4 36.53,18.54 36.53,19.69 36.03,20.19 31.58,20.19 31.2,20.57 31.2,21.97 30.18,22.99 29.3,22.99 28.91,23.37 28.91,25.02 29.17,25.27 31.6,25.27 C13.2 32.6,26.29
N$18
  Bottom 0.203: P1.P$20 43.42,25.38 42.25,26.54 38.57,26.54 36.41,24.38 36.41,23.5 36.15,23.24 33.61,23.24 32.6,24.26 C13.1
N$19
  Bottom 0.203: P1.P$21 42.92,19.34 42.12,18.54 42.12,13.08 40.6,11.56 39.58,11.56 C12.1 39.95,11.57 39.96,11.56
N$20  (via drill 0.6)
  Top 0.203: v42.5,24.76 42.5,14.73 v41.23,13.46
  Bottom 0.203: C12.2 41.12,13.57 v41.23,13.46 | 42.38,22.99 | 42.38,22.99 P1.P$22 | v42.5,24.76 42.5,23.11 42.38,22.99
N$21
  Bottom 0.203: P1.P$23 41.92,19.35 40.85,18.29 C11.1
N$22
  Bottom 0.203: C10.1 30.06,24.26 31.58,22.73 36.41,22.73 36.92,23.24 36.92,24.13 38.82,26.03 40.85,26.03 41.49,25.4 41.49,24.13 41.36,24 41.36,22.99 P1.P$24
N$23  (via drill 0.6)
  Top 0.203: v36.28,14.99 36.53,15.24 v36.53,17.27
  Bottom 0.203: P1.P$25 40.92,21.14 40.73,21.34 37.8,21.34 37.04,20.57 37.04,17.78 v36.53,17.27 | 37.04,13.34 C9.1 37.04,14.1 v36.28,14.99
N$24
  Bottom 0.203: P1.P$26 40.42,23.82 40.98,24.38 40.98,25.27 40.73,25.53 38.95,25.53 37.42,24 37.42,23.11 36.53,22.22 33.61,22.22 32.6,21.21 C8.1 32.6,21.08
N$25
  Bottom 0.203: P1.P$27 39.92,19.51 38.31,17.91 C7.1
N$27  (via drill 0.6)
  Top 0.203: LED3.C 83.51,28.19 81.11,28.19 79.59,29.72 79.59,32.38 81.24,34.04 81.24,36.45 81.75,36.96 83.27,36.96 84.16,37.85 v84.16,39.88
  Bottom 0.203: R9.1 85.94,40.13 84.41,40.13 v84.16,39.88
N$28  (via drill 0.6)
  Top 0.406: v85.94,17.4 86.06,17.53 v86.06,20.57 85.81,20.95 85.81,23.88 86.7,24.76 v86.83,24.76 | v89.37,19.81 v89.37,22.22 | v85.94,14.1 v88.48,14.1
  Bottom 0.203: C6.1 95.72,22.1 95.17,21.56 arc-45 94.95,21.46
  Bottom 0.406: 94.95,21.46 IC1.17 91.65,21.46 90.89,22.22 v89.37,22.22 | 86.1,20.66 IC1.38 80.57,20.66 80.1,20.19 78.32,20.19 77.3,21.21 77.32,21.22 C32.1 | 86.1,20.66 86.19,20.66 86.19,20.7 v86.06,20.57 | v85.94,17.4 85.94,17.65 86.32,17.15 86.32,15.75 IC1.29 86.41,14.13 v85.94,14.1 | v86.83,24.76 86.83,25.4 86.41,25.82 IC1.5 86.45,27.3 86.45,28.19 85.81,28.83 85.81,29.23 C33.1 | 86.1,20.66 86.45,20.32 88.99,20.32 89.49,19.81 v89.37,19.81 | 88.01,14.1 88.01,13.5 87.84,13.34 87.84,12.95 88.22,12.57 C34.1 | 88.01,14.1 IC1.27 | v88.48,14.1 88.01,14.1
  Bottom 0.813: C6.1 95.84,22.1 95.84,25.27 arc45 95.75,25.49 L1.1
N$29  (via drill 0.6)
  Top 0.203: v79.21,13.59 79.21,14.6 78.44,15.37 77.68,15.37 77.3,14.99 76.41,14.99 73.87,17.53 64.73,17.53 62.95,19.3 62.95,20.95 62.06,21.84 59.52,21.84 58.63,20.95 55.97,20.95 48.98,27.94 LED2.C 49.03,27.86 48.98,27.81
  Bottom 0.203: R8.1 80.86,13.54 v79.21,13.59
N$30  (via drill 0.6)
  Top 0.203: LED1.C 14.31,27.94 v16.6,27.94
  Bottom 0.203: R7.1 19.9,20.32 19.39,20.32 18.88,20.83 18.88,21.46 16.98,23.37 16.98,27.56 v16.6,27.94
N$31  (via drill 0.6)
  Top 0.203: v105.5,52.96 107.78,52.96 v108.67,53.97
  Bottom 0.203: IC2.14 103.59,44.96 104.48,45.85 104.48,51.94 v105.5,52.96 | v108.67,53.97 108.04,54.61 108.04,59.94 108.92,60.83 110.07,60.83 SV2.3
N$32  (via drill 0.6)
  Top 0.203: v20.13,29.72 19.64,29.19 v19.64,27.81 | v87.84,32.26 87.21,32.26 86.83,32.64 84.54,32.64 84.03,32.13 v84.03,31.75
  Bottom 0.203: 91.14,27.33 IC1.11 91.19,27.26 91.14,27.31 91.27,27.43 91.27,28.83 89.87,30.23 88.99,30.23 88.48,30.73 88.48,31.75 v87.84,32.26 | v20.13,29.72 21.47,28.5 | 21.47,28.5 21.53,28.45 | v19.64,27.81 19.64,27.05 20.28,26.42 20.26,26.42 Q4.1 | 21.47,28.5 21.42,28.45 29.42,28.45 31.84,30.1 33.36,30.1 34.88,29.34 34.88,28.45 35.65,27.56 45.17,27.56 46.06,28.45 63.59,28.45 66.13,30.99 67.78,30.99 68.16,31.37 79.46,31.37 79.84,30.99 81.49,30.99 81.75,31.24 83.02,31.24 83.52,31.75 v84.03,31.75
N$33
  Bottom 0.203: SV2.2 109.16,63.35 107.53,61.98 107.53,53.85 104.99,51.05 104.99,45.59 103.08,43.69 IC2.13
N$34  (via drill 0.6)
  Top 0.203: v90,28.83 90,30.48 90.51,31.12 90.51,34.8 87.21,38.1 87.21,43.56 87.72,44.07 88.35,44.07 91.27,41.15 v99.91,41.15
  Bottom 0.203: IC1.10 90.41,28.42 v90,28.83 | 101.94,41.15 IC2.11 v99.91,41.15
N$35  (via drill 0.6)
  Top 0.203: v88.6,28.83 89.62,27.69 92.8,27.69 94.7,29.59 96.73,29.59 99.27,27.05 104.61,27.05 v105.37,27.81
  Bottom 0.203: IC1.9 89.62,27.28 89.62,27.94 v88.6,28.83 | 104.99,29.46 R18.2 104.99,28.19 v105.37,27.81
N$36
  Bottom 0.203: C2.2 110.32,48.02 110.32,43.69 109.05,42.42 IC2.5 108.04,42.42
N$37
  Bottom 0.203: IC2.4 106.51,43.69 105.75,42.93 104.99,42.93 104.35,43.56 104.35,44.32 105.5,45.47 105.5,50.55 107.53,52.83 111.21,52.83 111.97,52.07 C2.1
N$38
  Bottom 0.203: C1.2 109.69,49.42 109.69,45.59 109.05,44.96 IC2.3 108.04,44.96
N$39
  Bottom 0.203: C1.1 108.53,51.67 108.04,51.18 108.04,47.5 IC2.1
N$40  (via drill 0.6)
  Top 0.203: v104.1,40.77 104.1,42.67 v105.37,43.94
  Bottom 0.203: IC2.2 106.64,46.23 106,45.59 106,45.21 105.37,44.58 v105.37,43.94 | C5.1 104.1,36.18 v104.1,40.77
N$41
  Bottom 0.203: IC2.6 106.64,41.15 106.26,40.77 C3.1 106.26,35.69
N$42  (via drill 0.6)
  Top 0.203: v93.3,26.92 93.3,25.27 95.59,22.99 95.59,18.03 92.92,15.37 92.92,13.34 93.56,12.7 94.7,12.7 v95.59,11.81
  Bottom 0.203: 91.4,11.81 v95.59,11.81 | Q3.1 88.71,9.14 90.26,9.14 90.89,9.78 90.89,11.3 91.4,11.81 | 91.4,11.81 91.38,11.81 | IC1.13 93.11,24.76 93.94,24.76 94.19,25.02 94.19,25.91 93.3,26.8 v93.3,26.92
N$43  (via drill 0.6)
  Top 0.203: 86.19,12.32 86.16,12.35 | 86.19,12.32 SV1.5 | v85.56,25.27 85.18,24.89 85.18,20.32 85.43,20.07 85.43,19.18 84.92,18.67 84.92,13.59 86.19,12.32
  Bottom 0.203: IC1.4 arc45 85.56,27.14 v85.56,25.27
N$44  (via drill 0.6)
  Top 0.203: v88.22,35.05 89.11,35.05 90,34.16 90,31.75 v89.37,31.12
  Bottom 0.203: 92.03,26.44 IC1.12 | Q2.1 86.97,35.05 v88.22,35.05 | v89.37,31.12 89.75,31.12 92.03,28.83 92.03,26.44 | 92.03,26.44 92.03,26.42
N$45  (via drill 0.6)
  Top 0.203: LED5.C 27.7,15.05 v19.52,23.24
  Bottom 0.203: v19.52,23.24 20.28,23.24 21.04,22.48 21.04,21.21 22.44,19.81 R11.1
N$46
  Bottom 0.203: Q1.3 7.41,69.55 5.67,67.82 5.67,66.04 5.55,65.91 R10.2
N$47  (via drill 0.6)
  Top 0.203: LED6.C 38.04,28.19 36.79,28.19 v36.15,28.96 | v17.99,27.69 v17.99,30.73
  Bottom 0.203: 17.99,26.16 R12.1 v17.99,27.69 | v17.99,30.73 33.87,30.73 v36.15,28.96
N$48  (via drill 0.6)
  Top 0.203: v83.9,10.79 78.95,10.79 73.24,16.51 62.69,16.51 arc45 62.47,16.42 LED7.C
  Bottom 0.203: R13.1 85.3,10.29 84.79,10.79 v83.9,10.79
N$49
  Bottom 0.203: R11.2 22.44,23.62 21.89,24.17 Q4.3 18.2,24.17 17.99,24.38 R12.2 17.99,23.24 19.47,21.77 R7.2
N$50
  Bottom 0.203: Q3.3 88.48,5.72 87.46,5.72 86.32,6.86 86.32,7.49 85.3,8.51 | R8.2 83.02,11.89 83.02,10.16 84.67,8.51 85.3,8.51 | R14.2 86.83,10.03 85.3,8.51 | 85.3,8.51 R13.2
N$51
  Bottom 0.203: CATHODE.MP 6.35,63.33 6.31,63.37 7.5,64.57 R10.1
N$52
  Bottom 0.813: 95.46,56.39 IC3.7 97.75,56.39 99.91,54.23 D6.C 99.91,53.34 97.37,50.8 L2.P$1
N$53
  Bottom 0.203: R15.2 90.56,36.19 88.73,36.19 87.72,37.21 85.94,37.21 Q2.3 87.33,38.56 87.33,41.4 86.57,42.16 85.94,42.16 R9.2 84.79,43.23 84.79,44.83 85.81,45.85 85.94,45.85 R16.2
N$54  (via drill 0.6)
  Top 0.203: v90.13,24.38 90.13,25.27 85.81,29.59 82.51,29.59 v82.38,29.84 | v67.27,33.15 v67.27,30.1
  Top 0.305: v14.94,33.53 v24.09,33.53
  Bottom 0.203: v82.38,29.84 69.3,29.84 69.17,29.72 69.05,29.72 68.92,29.59 67.78,29.59 v67.27,30.1 | Q1.1 9.44,67.35 10.25,66.55 10.25,55.63 6.82,52.2 12.02,35.94 12.79,33.66 12.9,33.54 14.95,33.54 v14.95,33.53 v14.94,33.53 | IC1.16 92,22.26 91.91,22.35 91.78,22.35 90.13,24 v90.13,24.38 | v67.27,33.15 36.41,33.15 36.03,33.53 26.88,33.53 26.12,32.77 24.85,32.77 v24.09,33.53
N$55  (via drill 0.6)
  Top 0.203: LED10.C 27.62,4.54 v28.03,4.95
  Bottom 0.203: v28.03,4.95 R17.1
N$56  (via drill 0.6)
  Top 0.203: v81.75,13.97 80.48,13.97 78.57,15.88 76.79,17.65 76.16,17.65 76.03,17.53 75.4,17.53 74.38,18.54 72.22,18.54 71.59,19.18 71.59,26.29 73.11,27.81 73.09,27.83 LED8.C
  Bottom 0.203: v81.75,13.97 84.41,13.97 85.05,13.34 85.05,11.68 85.3,11.43 88.6,11.43 89.37,10.67 89.37,10.03 R14.1
N$57  (via drill 0.6)
  Top 0.203: LED9.C 107.65,28.03 107.65,33.15 105.75,35.05 v92.41,35.05
  Bottom 0.203: R15.1 91.22,33.86 v92.41,35.05
N$58  (via drill 0.6)
  Top 0.203: LED4.C 97.28,14.35 100.29,14.35 100.8,14.86 100.8,16.51 103.72,19.43 v103.72,20.32 | v108.16,36.83 107.78,36.45 90.13,36.45 88.1,38.48 v88.1,43.05
  Bottom 0.203: v108.16,36.83 109.31,36.83 109.81,36.32 109.81,35.43 108.54,34.16 108.54,32.26 107.27,30.99 107.27,26.8 106.13,25.65 106.13,22.1 104.35,20.32 v103.72,20.32 | R16.1 85.94,43.94 87.21,43.94 v88.1,43.05
N$59
  Bottom 0.203: R18.1 104.99,41.15 103.72,42.42 IC2.12
N$60  (via drill 0.6)
  Top 0.203: v19.39,18.29 19.39,14.35 v21.17,12.57
  Bottom 0.203: C23.+ 29.55,8.76 28.03,10.29 23.96,10.29 23.07,11.18 IC5.5 21.42,12.63 | 21.42,12.63 21.11,12.63 | C26.2 24.98,19.69 23.96,18.67 19.77,18.67 v19.39,18.29 | 21.42,12.63 21.42,12.57 v21.17,12.57
N$61  (via drill 0.6)
  Top 0.203: v26.37,22.86 26.37,20.07 v28.15,18.29
  Bottom 0.203: C26.1 25.34,21.83 v26.37,22.86 | R20.1 26.25,17.4 27.14,18.29 v28.15,18.29
N$62
  Bottom 0.203: IC5.6 24.34,11.56 24.85,11.05 27.9,11.05 30.31,13.46 30.31,14.99 30.44,15.11 C24.+
N$63
  Bottom 0.203: C23.- 34.36,8.62 28.91,3.17 24.22,3.17 21.04,6.35 5.8,53.97 8.47,56.64 HT1.MP
N$64  (via drill 0.6)
  Top 0.203: v22.95,17.65 22.95,11.05 v21.8,9.91
  Bottom 0.203: 23.71,17.27 R21.1 | 23.71,17.27 25.1,18.67 26.12,18.67 27.34,19.89 R19.1 27.97,19.89 29.17,21.08 30.06,21.08 R1.1 | C25.2 21.17,17.4 21.24,17.32 21.57,17.65 v22.95,17.65 23.07,17.65 23.45,17.27 23.71,17.27 | v21.8,9.91 23.07,9.91 24.34,8.64 IC5.3
N$65  (via drill 0.6)
  Top 0.203: v27.26,32.51 v27.27,32.5 27.26,29.08 28.66,27.69 28.66,25.4 v27.26,24 | v89.11,32.38 88.35,33.15 83.52,33.15 82.64,32.26 v82.64,32.13
  Bottom 0.203: IC1.14 93.02,23.88 94.19,23.88 94.7,24.38 94.7,27.94 93.94,28.7 92.92,28.7 89.75,31.88 v89.11,32.38 | 27.52,21.84 R19.2 27.26,22.02 v27.26,24 | v27.26,32.51 35.9,32.51 36.53,31.88 36.53,31.75 36.66,31.75 37.04,31.37 38.19,31.37 38.57,31.75 67.78,31.75 67.9,31.88 79.97,31.88 80.35,31.5 81.37,31.5 82,32.13 v82.64,32.13
N$66  (via drill 0.6)
  Top 0.203: v68.54,32.77 v68.54,30.48 | v83.52,30.48 85.68,30.48 88.22,27.94 88.73,27.94 v91.14,25.53 | v30.06,17.65 33.11,20.7 33.11,28.83 36.53,32.26 v37.68,32.26
  Bottom 0.203: v91.14,25.53 91.14,23.88 91.91,23.11 93.05,23.11 IC1.15 | R1.2 v30.06,17.65 | v68.54,30.48 81.75,30.48 82,30.73 83.27,30.73 v83.52,30.48 | v68.54,32.77 68.16,32.77 67.65,32.26 v37.68,32.26
N$68  (via drill 0.6)
  Top 0.203: SW4.P$1 96.85,62.62 99.02,60.45 105.37,60.45 v106.51,59.18 109.69,56.01 109.69,37.47 109.43,37.21 109.43,36.32 v108.8,35.69 | v99.78,15.24 99.78,16.26 102.7,19.18 102.7,20.57 103.72,21.59 v103.97,21.59
  Bottom 0.203: C28.1 104.99,59.31 105.11,59.18 v106.51,59.18 | v108.8,35.69 108.04,34.92 108.04,32.51 106.77,31.24 106.77,27.05 105.62,25.91 105.62,23.24 v103.97,21.59 | IC1.26 88.81,14.91 91.4,12.32 94.95,12.32 97.62,14.99 99.53,14.99 v99.78,15.24
N$71  (via drill 0.6)
  Top 0.203: SW1.P$1 26.24,26.54 v23.58,26.54 23.58,27.56 25.74,29.97 v25.74,33.66 | v91.4,19.56 90.26,20.7 90.26,22.48 89.24,23.5 89.24,25.53 86.83,27.94 86.19,27.94 85.05,29.08 82.76,29.08 82.64,28.96 82.13,28.96 81.11,29.97 81.11,33.27 81.75,33.91 81.75,34.42 v82.25,34.8
  Bottom 0.203: C31.1 25.61,26.29 23.83,26.29 v23.58,26.54 | IC1.22 92.94,17.53 91.91,17.53 91.91,19.05 v91.4,19.56 | v25.74,33.66 26.12,34.04 70.32,34.04 70.82,33.53 80.86,33.53 v82.25,34.8
N$72  (via drill 0.6)
  Top 0.203: SW2.P$1 65.25,26.53 65.27,26.54 65.87,26.54 v69.17,23.24 | v78.57,23.11 81.75,19.3 83.78,17.27 83.78,12.83 93.3,3.17 98,3.17 99.91,5.46 v99.91,9.14 | v96.61,10.67 94.95,10.67 93.56,12.06 93.05,12.06 91.78,13.34 v91.78,13.84
  Bottom 0.203: 90.38,15.64 IC1.24 90.38,15.69 90.38,14.6 91.14,13.84 v91.78,13.84 | v99.91,9.14 98.38,10.67 v96.61,10.67 97,10.67 C30.1 | v69.17,23.24 76.41,23.24 76.54,23.11 v78.57,23.11
N$73  (via drill 0.6)
  Top 0.203: SW3.P$1 95.72,26.54 | SW3.P$1 | SW3.P$1 96.1,26.16 96.1,17.15 v95.72,16.76
  Bottom 0.203: C29.1 95.73,16.65 v95.72,16.76 94.74,15.66 IC1.23
VCC  (via drill 0.6)
  Top 0.305: LED3.A 83.87,25.05 84.54,24.38 v84.54,19.69
  Top 0.406: 59.52,16.38 LED7.A | 59.52,16.38 59.14,16.76 52.79,16.76 49.03,20.53 LED2.A 48.41,25.09 47.2,26.29 47.2,27.43 46.95,27.69 43.9,27.69 41.36,25.15 41.36,24.26 40.6,23.5 39.84,23.5 38.31,25.02 | 38.31,25.02 38.29,25.04 LED6.A 38.31,25.08 38.31,25.02 | LED10.A 24.77,3.25 24.72,3.3 24.86,3.44 LED5.A | 24.85,14.35 24.86,14.36 LED5.A | LED1.A 14.32,24.88 20.15,19.05 22.95,19.05 24.85,17.15 LED5.A | LED5.A 26.34,12.95 30.06,12.95 38.31,21.21 38.31,25.02 | 59.52,16.38 59.52,18.54 v61.3,20.32 | v73.11,19.56 73.11,25.02 73.09,25.04 LED8.A 74.89,26.85 v74.89,27.56 | LED3.A 82,26.86 v82,26.92 | LED9.A 104.21,25.13 v103.97,24.89 102.57,24.89 101.94,25.53 98.38,25.53 96.99,24.13 96.99,16.13 96.73,15.88 96.22,15.88 95.97,15.62 95.58,15.62 LED4.A | v102.96,49.28 102.96,40.89 v99.4,37.34 v103.08,37.34
  Top 0.813: v82,26.92 81.87,27.05 80.6,27.05 78.7,28.96 78.7,32.64 80.48,34.42 80.48,38.23 v89.87,47.62 | v92.29,60.2 92.29,59.69 100.67,59.69 102.96,57.4 v102.96,49.28
  Bottom 0.305: v89.75,18.54 89.49,18.54 88.22,19.69 v84.54,19.69
  Bottom 0.406: v73.11,19.56 69.68,19.56 68.92,20.32 v61.3,20.32 | v82,26.92 81.37,27.56 v74.89,27.56 | v103.97,24.89 103.84,25.15 103.84,26.54 C21.2 103.72,26.91 103.72,30.86 103.34,31.24 | IC4.1 102.54,31.24 103.34,31.24 | C5.2 103.72,33.91 | 103.34,31.24 103.72,31.62 C5.2 | IC2.16 100.42,47.5 | 100.54,35.69 C4.1 100.54,36.19 v99.4,37.34 | C5.2 103.61,33.8 103.59,33.78 102.83,33.78 102.45,34.16 102.45,36.83 102.96,37.34 v103.08,37.34 | v102.96,49.28 101.94,48.26 101.94,47.5
  Bottom 0.813: L2.P$4 v89.87,47.62 | IC2.16 101.94,47.5 101.81,47.62 | L2.P$4 | 89.87,52.7 L2.P$4 | 89.87,52.7 89.87,54.67 IC3.1 92.16,55.12 92.54,55.5 92.54,59.94 v92.29,60.2 C19.+ 89.23,63.51 87.08,65.66 87.08,67.44 87.09,67.45 ANODE.MP 87.09,67.57 87.08,67.56 | C18.2 88.62,52.7 89.87,52.7

### Text on the board
Documentation: Cut out area
tPlace: LBM elektronik
tNames: Part # 1000 0007
Document: View area
lcd: LCD